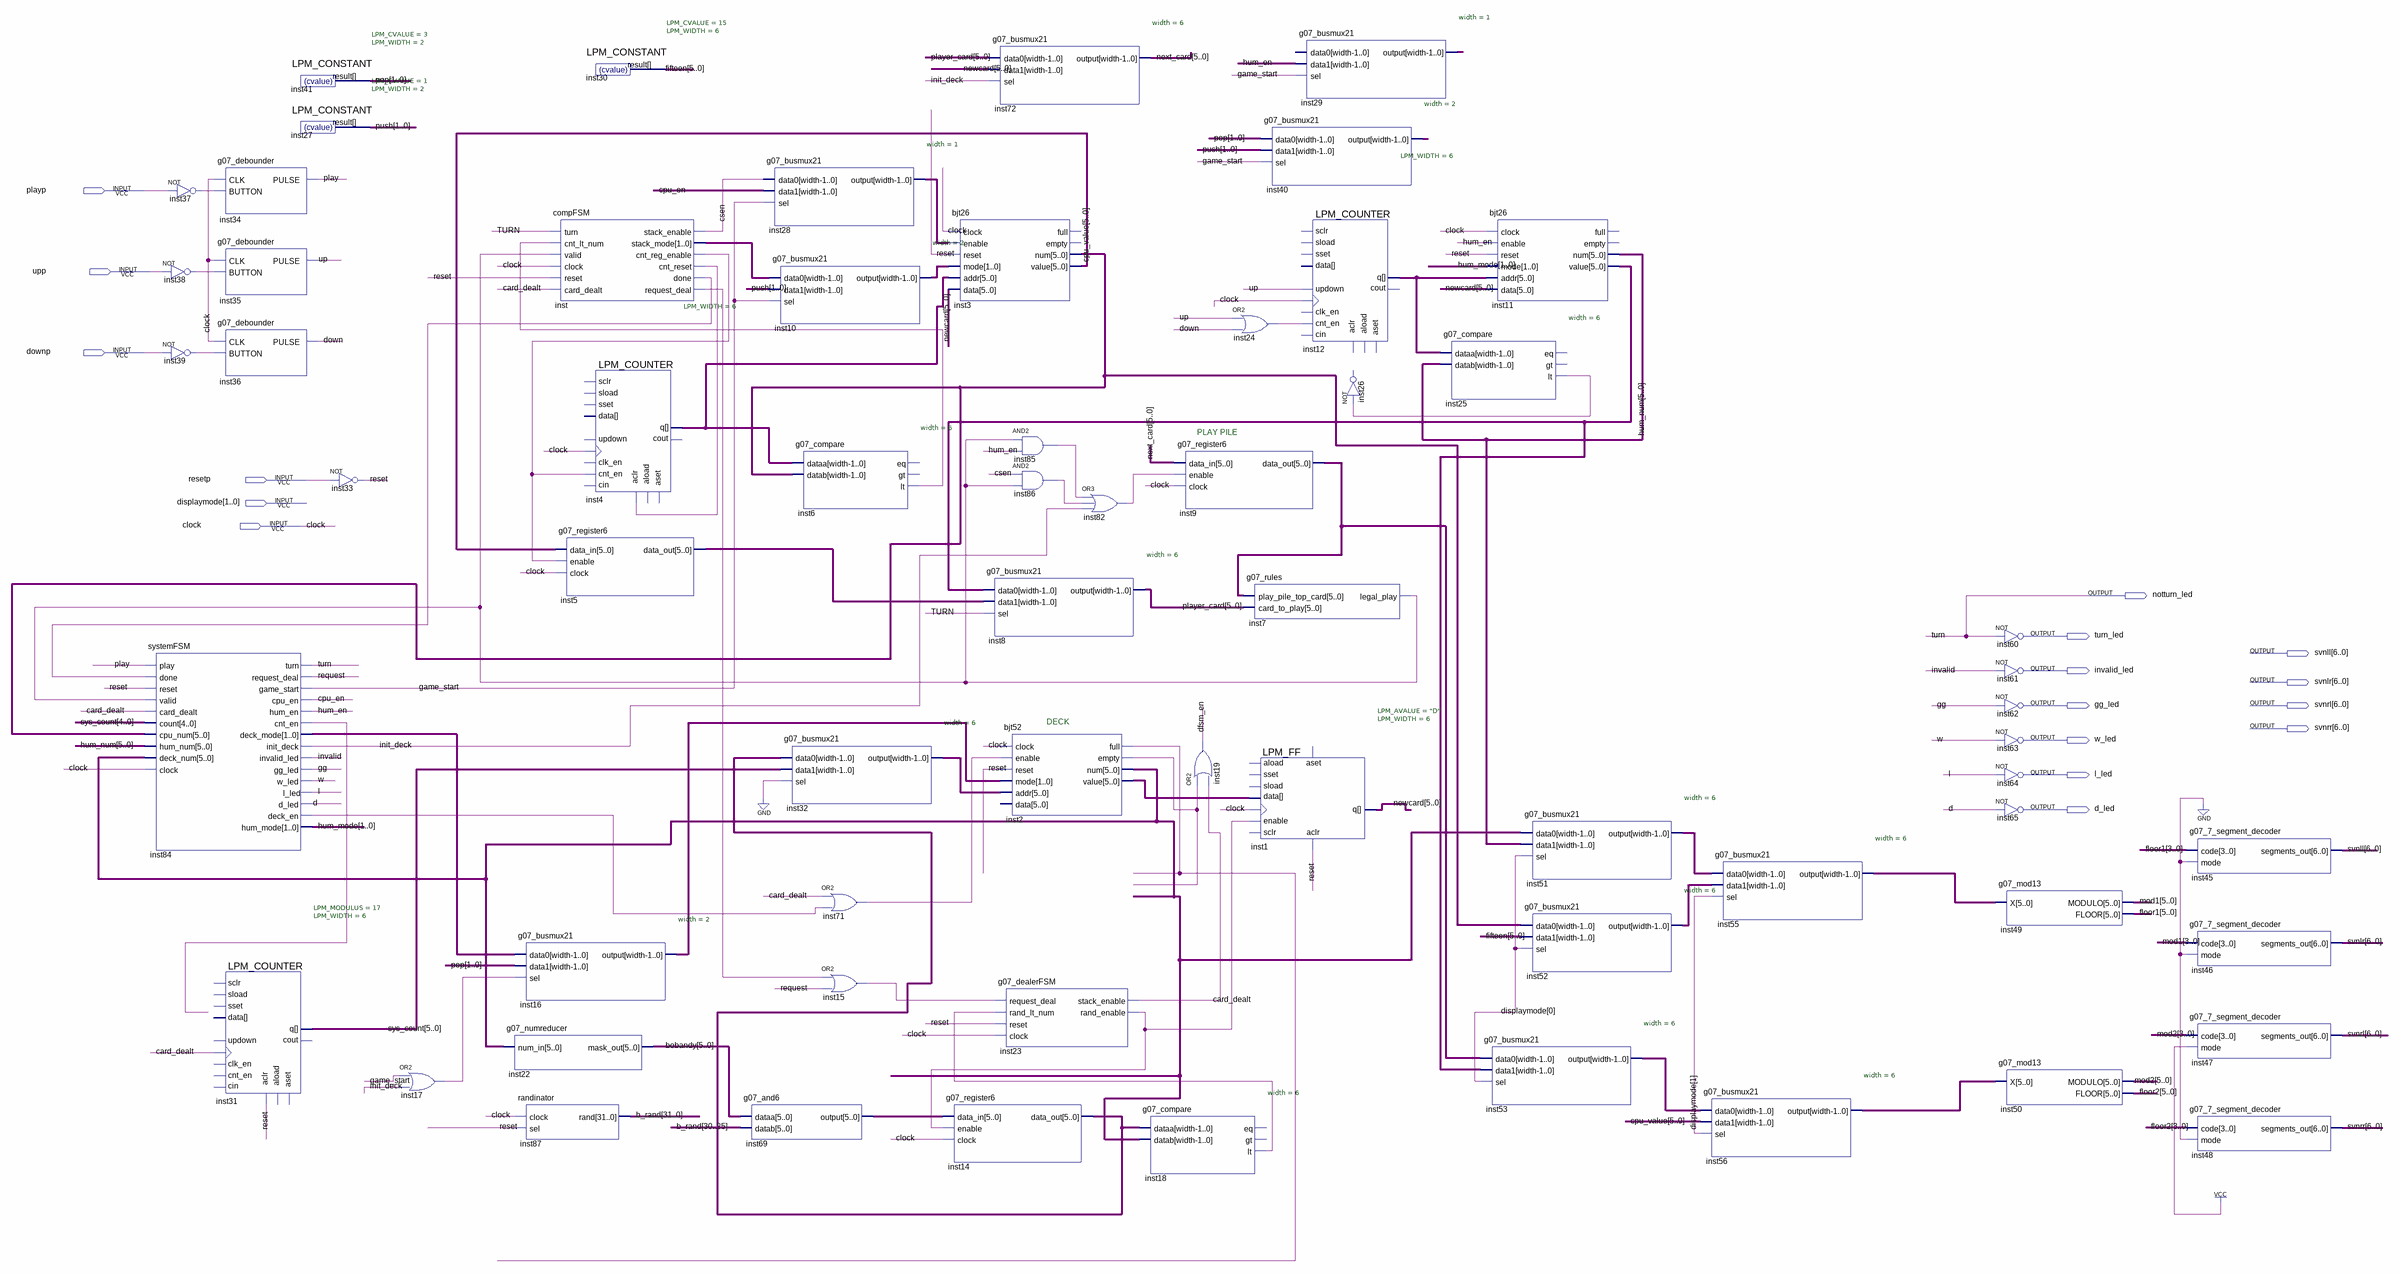
[diagram p0: schematic sheet]
// Quartus schematic g07_lab5.bdf as structural Verilog: 64 symbols, 17 pins
module g07_lab5 (
  input  playp,
  input  upp,
  input  downp,
  input  resetp,
  input  [1:0] displaymode,
  input  clock,
  output notturn_led,
  output turn_led,
  output [6:0] svnll,
  output invalid_led,
  output [6:0] svnlr,
  output gg_led,
  output [6:0] svnrl,
  output [6:0] svnrr,
  output w_led,
  output l_led,
  output d_led
);

  wire card_dealt, cpu_en, csen, d, dfsm_en, down, game_start, gg, hum_en, init_deck, inst2_empty,
       inst2_full, inst6_lt, inst7_legal_play, inst15_out, inst17_out, inst18_lt, inst23_rand_enable,
       inst24_out, inst25_lt, inst28_output, inst29_output, inst37_out, inst38_out, inst39_out, inst71_out,
       inst82_out, inst84_cnt_en, inst84_deck_en, inst85_out, inst86_out, inst_cnt_reg_enable,
       inst_cnt_reset, inst_done, inst_request_deal, invalid, l, play, request, reset, up, w;
  wire [1:0] hum_mode, inst10_output, inst16_output, inst40_output, inst84_deck_mode, inst_stack_mode, pop,
       push;
  wire [5:0] bobandy, cpu_value, fifteen, floor1, floor2, hum_num, inst2_num, inst2_value, inst3_num,
       inst4_q, inst5_data_out, inst9_data_out, inst11_value, inst12_q, inst14_data_out, inst32_output,
       inst51_output, inst52_output, inst53_output, inst55_output, inst56_output, inst69_output, mod1, mod2,
       newcard, next_card, player_card, sys_count;
  wire [31:0] b_rand;

  systemFSM inst84 (
    .play(play), .done(inst_done), .reset(reset), .valid(inst7_legal_play), .card_dealt(card_dealt),
    .count(sys_count[4:0]), .cpu_num(inst3_num), .hum_num(hum_num), .deck_num(inst2_num), .clock(clock),
    .turn(notturn_led), .request_deal(request), .game_start(game_start), .cpu_en(cpu_en), .hum_en(hum_en),
    .cnt_en(inst84_cnt_en), .deck_mode(inst84_deck_mode), .init_deck(init_deck), .invalid_led(invalid),
    .gg_led(gg), .w_led(w), .l_led(l), .d_led(d), .deck_en(inst84_deck_en), .hum_mode(hum_mode));
  not inst37 (inst37_out, playp);
  not inst38 (inst38_out, upp);
  not inst39 (inst39_out, downp);
  g07_debounder inst34 (.CLK(clock), .BUTTON(inst37_out), .PULSE(play));
  g07_debounder inst35 (.CLK(clock), .BUTTON(inst38_out), .PULSE(up));
  g07_debounder inst36 (.CLK(clock), .BUTTON(inst39_out), .PULSE(down));
  LPM_COUNTER #(.LPM_MODULUS(17), .LPM_WIDTH(6)) inst31 (
    .clock(card_dealt), .aclr(reset), .q(sys_count));  // open: sload, data, clk_en, aload, aset, cin, sset, updown, cnt_en, sclr, cout
  LPM_CONSTANT #(.LPM_CVALUE(3), .LPM_WIDTH(2)) inst41 (.result(pop));
  LPM_CONSTANT #(.LPM_CVALUE(1), .LPM_WIDTH(2)) inst27 (.result(push));
  not inst33 (reset, resetp);
  or inst17 (inst17_out, game_start, init_deck);
  g07_busmux21 #(.width(2)) inst16 (.data0(inst84_deck_mode), .data1(pop), .sel(inst17_out), .\output (inst16_output));
  g07_numreducer inst22 (.num_in(inst2_num), .mask_out(bobandy));
  randinator inst87 (.clock(clock), .sel(reset), .\rand (b_rand));
  compFSM inst (
    .turn(notturn_led), .cnt_lt_num(inst6_lt), .valid(inst7_legal_play), .clock(clock), .reset(reset),
    .card_dealt(card_dealt), .stack_enable(csen), .stack_mode(inst_stack_mode),
    .cnt_reg_enable(inst_cnt_reg_enable), .cnt_reset(inst_cnt_reset), .done(inst_done),
    .request_deal(inst_request_deal));
  g07_register6 inst5 (.data_in(cpu_value), .enable(inst_cnt_reg_enable), .clock(clock), .data_out(inst5_data_out));
  LPM_CONSTANT #(.LPM_CVALUE(15), .LPM_WIDTH(6)) inst30 (.result(fifteen));
  LPM_COUNTER #(.LPM_WIDTH(6)) inst4 (
    .clock(clock), .aclr(inst_cnt_reset), .cnt_en(inst_cnt_reg_enable), .q(inst4_q));  // open: sload, data, clk_en, aload, aset, cin, sset, updown, sclr, cout
  g07_and6 inst69 (.dataa(bobandy), .datab(b_rand[30:25]), .\output (inst69_output));
  g07_busmux21 #(.width(1)) inst28 (.data0(csen), .data1(cpu_en), .sel(game_start), .\output (inst28_output));
  g07_busmux21 #(.width(2)) inst10 (.data0(inst_stack_mode), .data1(push), .sel(game_start), .\output (inst10_output));
  g07_compare #(.width(6)) inst6 (.dataa(inst4_q), .datab(inst3_num), .lt(inst6_lt));  // open: eq, gt
  g07_busmux21 #(.width(6)) inst32 (.data0(inst14_data_out), .data1(sys_count), .sel(1'b0), .\output (inst32_output));
  or inst71 (inst71_out, card_dealt, inst84_deck_en);
  or inst15 (inst15_out, inst_request_deal, request);
  g07_register6 inst14 (
    .data_in(inst69_output), .enable(inst23_rand_enable), .clock(clock), .data_out(inst14_data_out));
  g07_busmux21 #(.width(6)) inst72 (.data0(player_card), .data1(newcard), .sel(init_deck), .\output (next_card));
  bjt26 inst3 (
    .clock(clock), .enable(inst28_output), .reset(reset), .mode(inst10_output), .addr(inst4_q),
    .data(newcard), .num(inst3_num), .value(cpu_value));  // open: full, empty
  g07_busmux21 #(.width(6)) inst8 (
    .data0(inst11_value), .data1(inst5_data_out), .sel(notturn_led), .\output (player_card));
  and inst85 (inst85_out, inst7_legal_play, hum_en);
  and inst86 (inst86_out, csen, inst7_legal_play);
  bjt52 inst2 (
    .clock(clock), .enable(inst71_out), .reset(reset), .mode(inst16_output), .addr(inst32_output),
    .full(inst2_full), .empty(inst2_empty), .num(inst2_num), .value(inst2_value));  // open: data
  g07_dealerFSM inst23 (
    .request_deal(inst15_out), .rand_lt_num(inst18_lt), .reset(reset), .clock(clock),
    .stack_enable(card_dealt), .rand_enable(inst23_rand_enable));
  or inst82 (inst82_out, inst85_out, inst86_out, init_deck);
  g07_register6 inst9 (.data_in(next_card), .enable(inst82_out), .clock(clock), .data_out(inst9_data_out));
  g07_compare #(.width(6)) inst18 (.dataa(inst14_data_out), .datab(inst2_num), .lt(inst18_lt));  // open: eq, gt
  or inst19 (dfsm_en, inst2_empty, card_dealt);
  g07_busmux21 #(.width(2)) inst40 (.data0(pop), .data1(push), .sel(game_start), .\output (inst40_output));
  or inst24 (inst24_out, up, down);
  g07_rules inst7 (.play_pile_top_card(inst9_data_out), .card_to_play(player_card), .legal_play(inst7_legal_play));
  LPM_FF #(.LPM_AVALUE("D"), .LPM_WIDTH(6)) inst1 (
    .enable(inst23_rand_enable), .clock(clock), .aclr(reset), .data(inst2_value), .q(newcard));  // open: aload, sset, sload, aset, sclr
  g07_busmux21 #(.width(1)) inst29 (.data1(hum_en), .sel(game_start), .\output (inst29_output));  // open: data0
  LPM_COUNTER #(.LPM_WIDTH(6)) inst12 (
    .clock(clock), .updown(up), .cnt_en(inst24_out), .q(inst12_q));  // open: sload, data, clk_en, aload, aclr, aset, cin, sset, sclr, cout
  // NOT inst26 has open pins: IN=inst25_lt, OUT=open
  g07_compare #(.width(6)) inst25 (.dataa(inst12_q), .datab(hum_num), .lt(inst25_lt));  // open: eq, gt
  bjt26 inst11 (
    .clock(clock), .enable(hum_en), .reset(reset), .mode(hum_mode), .addr(inst12_q), .data(newcard),
    .num(hum_num), .value(inst11_value));  // open: full, empty
  g07_busmux21 #(.width(6)) inst53 (
    .data0(inst9_data_out), .data1(inst11_value), .sel(displaymode[0]), .\output (inst53_output));
  g07_busmux21 #(.width(6)) inst51 (.data0(inst2_num), .data1(hum_num), .sel(displaymode[0]), .\output (inst51_output));
  g07_busmux21 #(.width(6)) inst52 (.data0(inst3_num), .data1(fifteen), .sel(displaymode[0]), .\output (inst52_output));
  g07_busmux21 #(.width(6)) inst55 (
    .data0(inst51_output), .data1(inst52_output), .sel(displaymode[1]), .\output (inst55_output));
  g07_busmux21 #(.width(6)) inst56 (
    .data0(inst53_output), .data1(cpu_value), .sel(displaymode[1]), .\output (inst56_output));
  not inst60 (turn_led, notturn_led);
  not inst61 (invalid_led, invalid);
  not inst62 (gg_led, gg);
  not inst63 (w_led, w);
  not inst64 (l_led, l);
  not inst65 (d_led, d);
  g07_mod13 inst49 (.X(inst55_output), .MODULO(mod1), .FLOOR(floor1));
  g07_mod13 inst50 (.X(inst56_output), .MODULO(mod2), .FLOOR(floor2));
  g07_7_segment_decoder inst45 (.code(floor1[3:0]), .mode(1'b0), .segments_out(svnll));
  g07_7_segment_decoder inst46 (.code(mod1[3:0]), .mode(1'b0), .segments_out(svnlr));
  g07_7_segment_decoder inst47 (.code(mod2[3:0]), .mode(1'b1), .segments_out(svnrl));
  g07_7_segment_decoder inst48 (.code(floor2[3:0]), .mode(1'b0), .segments_out(svnrr));

  // Other names for the same wires on the sheet: TURN = notturn_led

  // Notes on the sheet:
  //   PLAY PILE
  //   DECK
endmodule
